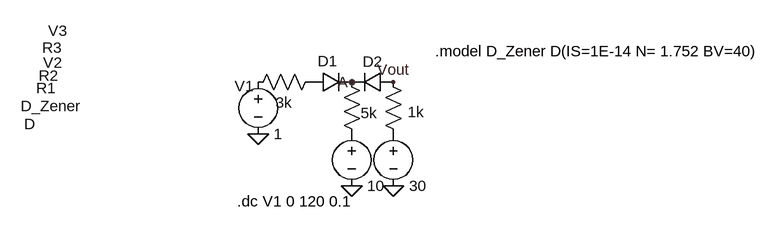
[diagram p0: schematic Ε2024_Η1.asc]
Ε2024_Η1.asc, the LTspice schematic file:
Version 4
SHEET 1 880 680
FLAG 64 240 0
FLAG -80 160 0
FLAG 128 240 0
FLAG 128 80 Vout
FLAG 64 80 A
SYMBOL voltage -80 64 R0
WINDOW 0 -36 22 Left 2
WINDOW 123 0 0 Left 0
WINDOW 39 0 0 Left 0
SYMATTR InstName V1
SYMATTR Value 1
SYMBOL res 16 64 R90
WINDOW 0 41 422 VBottom 2
WINDOW 3 32 56 VTop 2
SYMATTR InstName R1
SYMATTR Value 3k
SYMBOL diode 0 96 R270
WINDOW 0 33 27 VTop 2
WINDOW 3 -33 -431 VBottom 2
SYMATTR InstName D1
SYMBOL res 48 64 R0
WINDOW 0 -466 6 Left 2
WINDOW 3 30 64 Left 2
SYMATTR InstName R2
SYMATTR Value 5k
SYMBOL voltage 64 144 R0
WINDOW 0 -475 -94 Left 2
WINDOW 123 0 0 Left 0
WINDOW 39 0 0 Left 0
SYMATTR InstName V2
SYMATTR Value 10
SYMBOL diode 128 64 R90
WINDOW 0 0 32 VBottom 2
WINDOW 3 37 526 VTop 2
SYMATTR InstName D2
SYMATTR Value D_Zener
SYMBOL res 112 64 R0
WINDOW 0 -524 -37 Left 2
WINDOW 3 38 62 Left 2
SYMATTR InstName R3
SYMATTR Value 1k
SYMBOL voltage 128 144 R0
WINDOW 0 -531 -143 Left 2
WINDOW 123 0 0 Left 0
WINDOW 39 0 0 Left 0
SYMATTR InstName V3
SYMATTR Value 30
TEXT 192 32 Left 2 !.model D_Zener D(IS=1E-14 N= 1.752 BV=40)
TEXT -112 264 Left 2 !.dc V1 0 120 0.1

The netlist it stands for:
* Ε2024_Η1.asc
V1 P001 0 1
R1 P002 P001 3k
D1 P002 A D
R2 A P003 5k
V2 P003 0 10
D2 Vout A D_Zener
R3 Vout P004 1k
V3 P004 0 30
.model D D
.lib standard.dio
.model D_Zener D(IS=1E-14 N= 1.752 BV=40)
.dc V1 0 120 0.1
.backanno
.end